# EAGLE schematic board_kelengkeng_v2 (EAGLE 9.6.2)
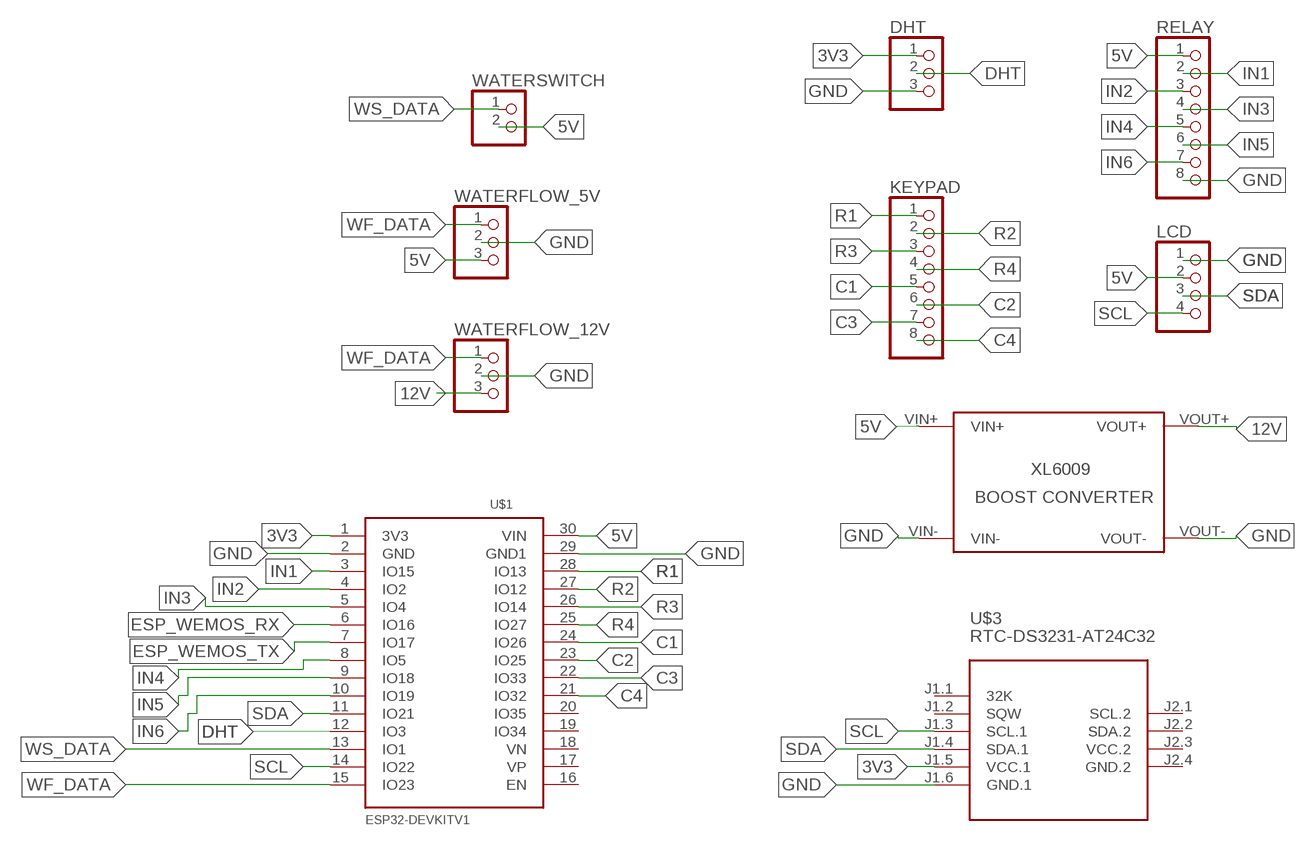
[diagram p0: schematic, sheet 1]

## Parts
DHT  PINHD-1X3  [1X03]
KEYPAD  PINHD-1X8  [1X08]
LCD  PINHD-1X4  [1X04]
RELAY  PINHD-1X8  [1X08]
U$1  ESP32DEVKITV1  [ESP32-DEVKITV1]
U$2  XL6009  [XL6009]
U$3  RTC-DS3231-AT24C32  [RTC-DS3231-AT24C32]
WATERFLOW_5V  PINHD-1X3  [1X03]
WATERFLOW_12V  PINHD-1X3  [1X03]
WATERSWITCH  PINHD-1X2  [1X02]

## Nets
3V3: DHT.1 U$1.1(3V3) U$3.J1.5(VCC.1)
5V: LCD.2 RELAY.1 U$1.30(VIN) U$2.VIN+ WATERFLOW_5V.3 WATERSWITCH.2
12V: U$2.VOUT+ WATERFLOW_12V.3
C1: KEYPAD.5 U$1.24(IO26)
C2: KEYPAD.6 U$1.23(IO25)
C3: KEYPAD.7 U$1.22(IO33)
C4: KEYPAD.8 U$1.21(IO32)
DHT: DHT.2 U$1.12(IO3)
ESP_WEMOS_RX: U$1.6(IO16)
ESP_WEMOS_TX: U$1.7(IO17)
GND: DHT.3 LCD.1 RELAY.8 U$1.2(GND) U$1.29(GND1) U$2.VIN- U$2.VOUT- U$3.J1.6(GND.1) WATERFLOW_5V.2 WATERFLOW_12V.2
IN1: RELAY.2 U$1.3(IO15)
IN2: RELAY.3 U$1.4(IO2)
IN3: RELAY.4 U$1.5(IO4)
IN4: RELAY.5 U$1.8(IO5)
IN5: RELAY.6 U$1.9(IO18)
IN6: RELAY.7 U$1.10(IO19)
R1: KEYPAD.1 U$1.28(IO13)
R2: KEYPAD.2 U$1.27(IO12)
R3: KEYPAD.3 U$1.26(IO14)
R4: KEYPAD.4 U$1.25(IO27)
SCL: LCD.4 U$1.14(IO22) U$3.J1.3(SCL.1)
SDA: LCD.3 U$1.11(IO21) U$3.J1.4(SDA.1)
WF_DATA: U$1.15(IO23) WATERFLOW_5V.1 WATERFLOW_12V.1
WS_DATA: U$1.13(IO1) WATERSWITCH.1
Unconnected: U$1.16(EN) U$1.17(VP) U$1.18(VN) U$1.19(IO34) U$1.20(IO35) U$3.J1.1(32K) U$3.J1.2(SQW) U$3.J2.1(SCL.2) U$3.J2.2(SDA.2)

## Power pins joined to a net without a drawn wire
GND.2: U$3.J2.4(GND.2)
VCC.2: U$3.J2.3(VCC.2)

## Library data of the parts
DHT WATERFLOW_5V WATERFLOW_12V = pinhead:PINHD-1X3: PIN HEADER
KEYPAD RELAY = pinhead:PINHD-1X8: PIN HEADER
LCD = pinhead:PINHD-1X4: PIN HEADER
U$1 = ESP32-DEVKITV1:ESP32DEVKITV1
U$2 = mario:XL6009
U$3 = diy-modules:RTC-DS3231-AT24C32: RTC Module with Battery and EEPROM based on DS3231 and AT24C32 chips Tutorial can be found here: https://edwardmallon.wordpress.com/2014/05/21/using-a-cheap-3-ds3231-rtc-at24c32-eeprom-from-ebay/ Click here to find device on ebay.com <http://www.ebay.com/sch/DS3231+AT24C32+module>
WATERSWITCH = pinhead:PINHD-1X2: PIN HEADER